# Altium schematic sheet Accelerometer.SchDoc
size 209 x 297 mm; Author: Мурашкин Д.В.; Address1: Address1; Address2: Address2; Address3: Address3; Address4: Address4; DocumentNumber: SS19946-01; Scale: 1:1; Letter1Column: Э; PartName: Акселерометер
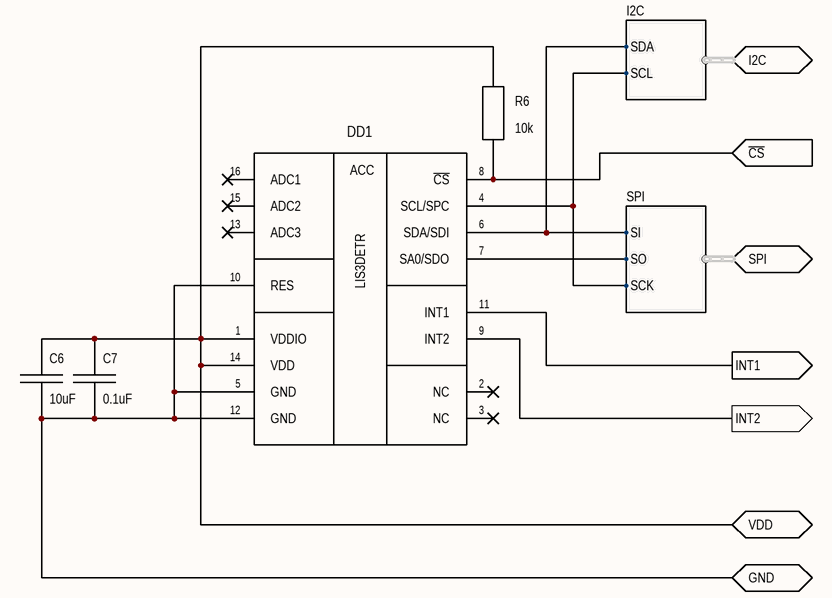
[diagram p0: Accelerometer.SchDoc]

## Parts
C6  10uF  [CAPC2012L]
C7  0.1uF  [CAPC1608L]
DD1  LIS3DETR  [LGA-16]
R6  10k  [RESC1608L]

## Ports
GND, I2C (harness I2C), INT1 (out), INT2 (out), SPI (harness SPI), VDD, ~{CS} (in)

## Harnesses
I2C: SDA, SCL
SPI: SI, SO, SCK

## Nets
~{CS}: DD1.8(~{CS}) R6.2 ; port ~{CS}
GND: C6.2 C7.2 DD1.5(GND) DD1.10(RES) DD1.12(GND) ; port GND
INT1: DD1.11(INT1) ; port INT1
INT2: DD1.9(INT2) ; port INT2
VDD: C6.1 C7.1 DD1.1(VDDIO) DD1.14(VDD) R6.1 ; port VDD
NetDD1_4: DD1.4(SCL/SPC) ; port I2C.SCL, port SPI.SCK
NetDD1_6: DD1.6(SDA/SDI) ; port I2C.SDA, port SPI.SI
NetDD1_7: DD1.7(SA0/SDO) ; port SPI.SO

Not connected (* = marked no-connect by the designer): DD1 2(NC)* 3(NC)* 13(ADC3)* 15(ADC2)* 16(ADC1)*

## Notes on the sheet
- Перв. примен.
- Справ. №
- Подп. и дата
- Инв. № дубл.
- Взам. инв. №
- Разраб.
- Изм.
- Лист
- № докум.
- Подп.
- Дата
- Лит.
- Масса
- Масштаб
- Пров.
- Т.контр.
- Листов
- Инв. № подл.
- Утв.
- Н.контр.
- 2.106-A4
- Копировал
- Формат А4
- (in symbol LIS3DETR) ACC

## Library data of the parts
C6 = CC0805KKX5R8BB106: Capacitor Ceramic 10uF 25V; Manufacturer: Yageo; Group: Ceramic Capacitors; Temperature Coefficient: X5R; Tolerance: ±10%; Short description: CAP CER 10UF 25V X5R 0805; Type: Ceramic; Part name: CC0805KKX5R8BB106; Voltage: 25V; Package: 2012; Value: 10uF
C7 = CC0603KRX7R8BB104: Capacitor Ceramic 0.1uF 25V; Manufacturer: Yageo; Group: Ceramic Capacitors; Temperature Coefficient: X7R; Tolerance: ±10%; Short description: CAP CER 0.1UF 25V X7R 0603; Type: Ceramic; Part name: CC0603KRX7R8BB104; Voltage: 25 V; Package: 1608; Value: 0.1uF
DD1 = LIS3DETR: MEMS Accelerometer; Manufacturer: STMicroelectronics; Group: Accelerometers; Short description: ACCEL 2-16G I2C/SPI 16LGA; Package: VFLGA-16; Part name: LIS3DETR
R6 = RC0603JR-0710KL: Resistor Ceramic 10k 1608; Manufacturer: Yageo; Group: Resistors; Temperature Coefficient: ±100ppm/°C; Tolerance: ±5%; Voltage: 75 V; Power: 0.1W; Short description: RES SMD 10K OHM 5% 1/10W 0603; Part name: RC0603JR-0710KL; Type: Thin Film; Package: 1608; Value: 10k